# Altium schematic sheet TopLevelDesign.SchDoc
size B; SheetNumber: 2; SheetTotal: 8
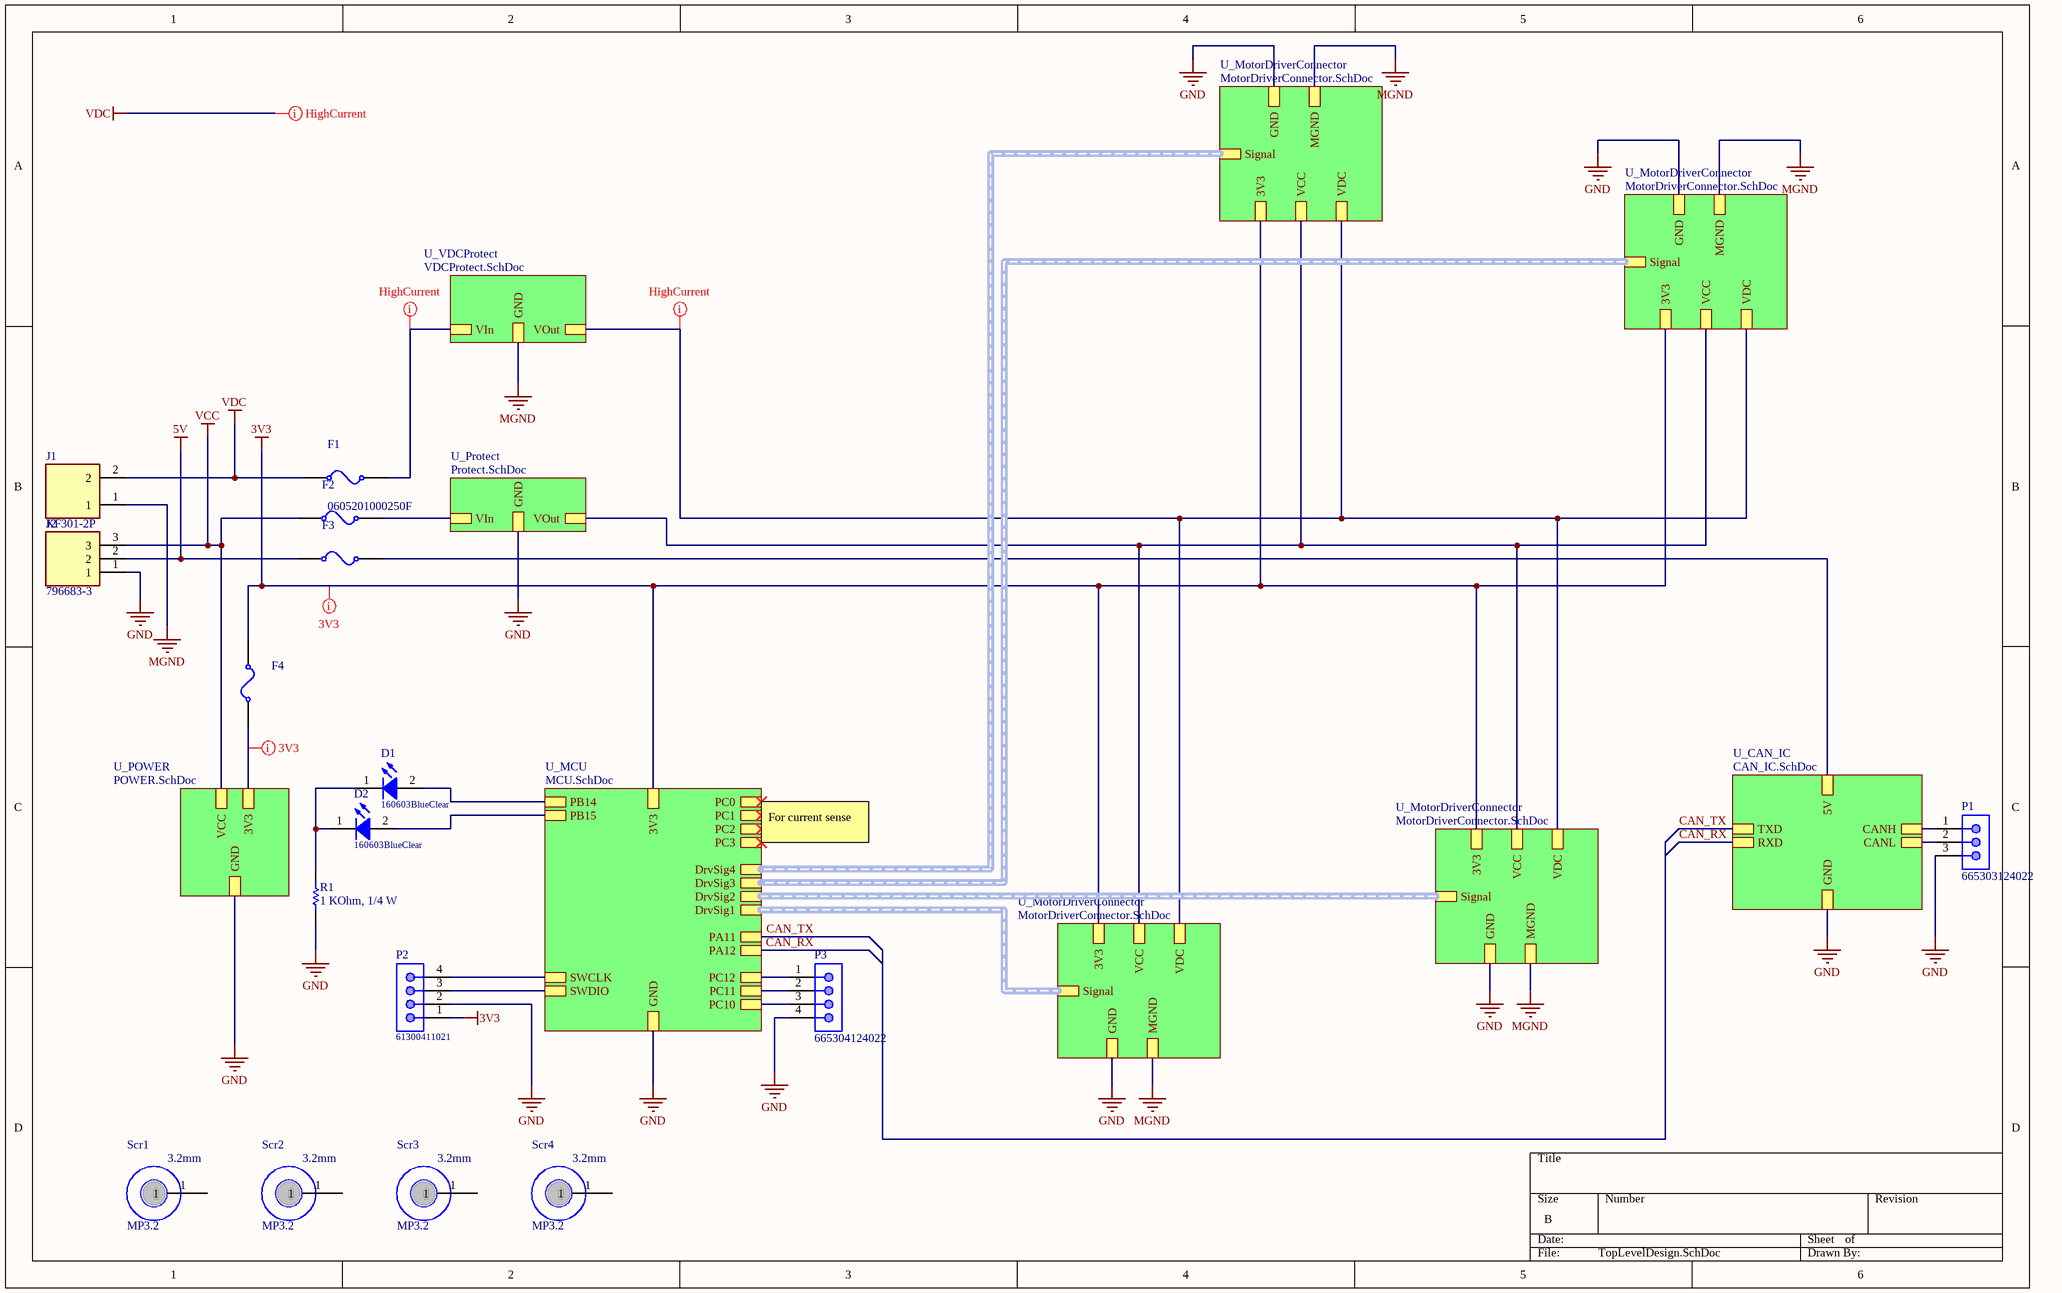
[diagram p0: TopLevelDesign.SchDoc]

## Parts
D1  160603BlueClear  [WL-SMCW_0603_H=0.7mm]
D2  160603BlueClear  [WL-SMCW_0603_H=0.7mm]
F1  0605201000250F  [Fuse_Clip_0520]
F2  061812110024  [Fuse_SMD_1812]  (value not drawn)
F3  061812110024  [Fuse_SMD_1812]  (value not drawn)
F4  061812020030  [Fuse_SMD_1812]  (value not drawn)
J1  KF301-2P  [HANDSON_KF301-2P]
J2  796683-3  [TE_796683-3]
P1  665303124022  [665303124022]
P2  61300411021  [61300411021]
P3  665304124022  [665304124022]
R1  value 1 KOhm, 1/4 W  [resistor_0603]  (hidden comment: 0006031021)
Scr1  MP3.2  [MP3.2]
Scr2  MP3.2  [MP3.2]
Scr3  MP3.2  [MP3.2]
Scr4  MP3.2  [MP3.2]

## Sub-sheets
U_CAN_IC = CAN_IC.SchDoc: CANH, CANL, TXD, RXD, 5V, GND
U_MCU = MCU.SchDoc: SWDIO, SWCLK, 3V3, GND, DrvSig1 (harness M_Driver_Signal1), DrvSig2 (harness M_Driver_Signal2), DrvSig3 (harness M_Driver_Signal3), DrvSig4 (harness M_Driver_Signal4), PC0, PC1, PC2, PC3, PC10, PC11, PC12, PA11, PA12, PB14, PB15
U_MotorDriverConnector = MotorDriverConnector.SchDoc: VCC, 3V3, GND, VDC, MGND, Signal (harness M_Driver_Entry)
U_MotorDriverConnector = MotorDriverConnector.SchDoc: VCC, 3V3, GND, VDC, MGND, Signal (harness M_Driver_Entry)
U_MotorDriverConnector = MotorDriverConnector.SchDoc: VCC, 3V3, GND, VDC, MGND, Signal (harness M_Driver_Entry)
U_MotorDriverConnector = MotorDriverConnector.SchDoc: VCC, 3V3, GND, VDC, MGND, Signal (harness M_Driver_Entry)
U_POWER = POWER.SchDoc: VCC, 3V3, GND
U_Protect = Protect.SchDoc: VIn, GND, VOut
U_VDCProtect = VDCProtect.SchDoc: VIn, GND, VOut

## Nets
3V3: F4.1 P2.1 ; sheet U_MotorDriverConnector/3V3, sheet U_MotorDriverConnector/3V3, sheet U_MotorDriverConnector/3V3, sheet U_MotorDriverConnector/3V3, sheet U_MCU/3V3
5V: F3.0 J2.2
GND: J2.1 P1.3 P2.2 P3.4 R1.1 ; sheet U_POWER/GND, sheet U_MotorDriverConnector/GND, sheet U_MotorDriverConnector/GND, sheet U_MotorDriverConnector/GND, sheet U_MotorDriverConnector/GND, sheet U_CAN_IC/GND, sheet U_MCU/GND, sheet U_Protect/GND
MGND: J1.1 ; sheet U_MotorDriverConnector/MGND, sheet U_MotorDriverConnector/MGND, sheet U_MotorDriverConnector/MGND, sheet U_MotorDriverConnector/MGND, sheet U_VDCProtect/GND
VCC: F2.0 J2.3 ; sheet U_POWER/VCC
VDC: F1.0 J1.2
CAN_RX: sheet U_CAN_IC/RXD, sheet U_MCU/PA12
CAN_TX: sheet U_CAN_IC/TXD, sheet U_MCU/PA11
NetD1_1: D1.1(K) D2.1(K) R1.2
NetD1_2: D1.2(A) ; sheet U_MCU/PB14
NetD2_2: D2.2(A) ; sheet U_MCU/PB15
NetF1_1: F1.1 ; sheet U_VDCProtect/VIn
NetF2_1: F2.1 ; sheet U_Protect/VIn
NetF3_1: F3.1 ; sheet U_CAN_IC/5V
NetF4_0: F4.0 ; sheet U_POWER/3V3
NetP1_1: P1.1 ; sheet U_CAN_IC/CANH
NetP1_2: P1.2 ; sheet U_CAN_IC/CANL
NetP2_3: P2.3 ; sheet U_MCU/SWDIO
NetP2_4: P2.4 ; sheet U_MCU/SWCLK
NetP3_1: P3.1 ; sheet U_MCU/PC12
NetP3_2: P3.2 ; sheet U_MCU/PC11
NetP3_3: P3.3 ; sheet U_MCU/PC10
(unnamed): sheet U_MotorDriverConnector/VCC, sheet U_MotorDriverConnector/VCC, sheet U_MotorDriverConnector/VCC, sheet U_MotorDriverConnector/VCC, sheet U_Protect/VOut
(unnamed): sheet U_MotorDriverConnector/VDC, sheet U_MotorDriverConnector/VDC, sheet U_MotorDriverConnector/VDC, sheet U_MotorDriverConnector/VDC, sheet U_VDCProtect/VOut

Not connected (* = marked no-connect by the designer): Scr1 1; Scr2 1; Scr3 1; Scr4 1

## Buses and harness runs
harness sheet U_MCU/DrvSig1 = sheet U_MotorDriverConnector/Signal
harness sheet U_MCU/DrvSig2 = sheet U_MotorDriverConnector/Signal
harness sheet U_MCU/DrvSig3 = sheet U_MotorDriverConnector/Signal
harness sheet U_MCU/DrvSig4 = sheet U_MotorDriverConnector/Signal

## Layout directives
rule Width Constraint [Pref Width = 50mil    Min Width = 50mil    Max Width = 100mil]: (no net found under the mark), NetF1_1, VDC
rule Width Constraint [Pref Width = 15mil    Min Width = 7mil    Max Width = 100mil]: 3V3, NetF4_0

## Notes on the sheet
- For current sense
- (in symbol CMP-143-000000-1) 3.2mm

## Library data of the parts
D1 D2 = CMP-004-00088-1: WL-SMCW SMT Mono-color Chip LED Waterclear, size 0603, Blue, 3.2V, 140deg; Type: Clear; Supplier 2 SN: 160-1647-2-ND; Pins: 2; Supplier 1 SN: 710-150060GS75000; ComponentLink3URL: https://www.digikey.com/en/products/detail/liteon/LTST-C191TBKT/388530; Color: Blue; Supplier 3 Name: ICDayRoi; Supplier 2 Name: Digi-Key; ComponentLink1URL: N/A; Source: WL-SMCW_0603.SchLib; ComponentLink4URL: https://www.thegioiic.com/led-xanh-duong-0603-dan-smd-trong-suot; Supplier 1 Name: Mouser; ComponentLink3Description: Supplier 2 URL; Component Type: Standard; ComponentLink1Description: Datasheet link; Value: Blue, 3.2V; ComponentLink2URL: https://www.mouser.vn/ProductDetail/Wurth-Elektronik/150060BS75003?qs=Li%252BoUPsLEnu8LvIbM48DKA%3D%3D; Size: 0603; Design Item ID: 160603BlueClear; Supplier 2 URL: https://www.digikey.com/en/products/detail/liteon/LTST-C191TBKT/388530; ComponentLink4Description: Supplier 3 URL; Supplier 3 URL: https://www.thegioiic.com/led-xanh-duong-0603-dan-smd-trong-suot; Supplier 3 SN: N/A; ComponentLink2Description: Supplier 1 URL; Supplier 1 URL: https://www.mouser.vn/ProductDetail/Wurth-Elektronik/150060BS75003?qs=Li%252BoUPsLEnu8LvIbM48DKA%3D%3D
F1 = CMP-005-00031-1: Glass Fuse, Size 0520, 250 VAC, 10A, F; Manufacturer: Littelfuse; Threshold Current: 100A (125VAC); Threshold Voltage: 250VAC; Supplier 1 SN: 576-0218010.HXP; Source: Fuse_Clip.SchLib; ComponentLink4Description: Supplier 3 URL; ComponentLink3URL: https://www.digikey.com/en/products/detail/littelfuse-inc/0218010-HXP/777141?s=N4IgTCBcDaIAxgIwA46LgOgBIA0AKIAugL5A; Supplier 1 Name: Mouser; Supplier 2 URL: https://www.digikey.com/en/products/detail/littelfuse-inc/0218010-HXP/777141?s=N4IgTCBcDaIAxgIwA46LgOgBIA0AKIAugL5A; Design Item ID: 0605201000250F; ComponentLink1URL: https://www.littelfuse.com/~/media/electronics/datasheets/fuses/littelfuse_fuse_234_datasheet.pdf.pdf; Value: 250 VAC, 10A; Supplier 2 SN: F2425-ND; Pins: 2; Hold Current: 10A; Supplier 2 Name: Digi-Key; Supplier 3 URL: https://www.thegioiic.com/cau-chi-ong-thuy-tinh-10a-5x20mm-toc-do-f; Component Type: Standard; ComponentLink4URL: https://www.thegioiic.com/cau-chi-ong-thuy-tinh-10a-5x20mm-toc-do-f; Fuse speed: F; ComponentLink3Description: Supplier 2 URL; Supplier 3 SN: N/A; ComponentLink2URL: https://www.mouser.vn/ProductDetail/Littelfuse/0218010.HXP?qs=YKoktUZms5K5aEWQkceb8A%3D%3D; Mounting Technology: Holder / Clip; ComponentLink2Description: Supplier 1 URL; Size: 0520; ComponentLink1Description: Datasheet link; Supplier 3 Name: thegioiic; Supplier 1 URL: https://www.mouser.vn/ProductDetail/Littelfuse/0218010.HXP?qs=YKoktUZms5K5aEWQkceb8A%3D%3D
F2 F3 = CMP-005-00055-1: Resettable Fuse, Size 1812, 24V, 1.1A; Manufacturer: Bourns; Threshold Current: 20A; Trip Current: 2.2A; ComponentLink2URL: https://www.mouser.vn/ProductDetail/Bourns/MF-MSMF110-24X-2?qs=tiksPeNXt0KSvkNsPEvQzw%3D%3D; ComponentLink1Description: Datasheet link; Supplier 2 SN: MF-MSMF110/24X-2TR-ND; Supplier 2 URL: https://www.mouser.vn/ProductDetail/Bourns/MF-MSMF110-24X-2?qs=tiksPeNXt0KSvkNsPEvQzw%3D%3D; Threshold Voltage: 24V; ComponentLink2Description: Supplier 1 URL; ComponentLink3URL: https://www.digikey.com/en/products/detail/bourns-inc/MF-MSMF110-24X-2/2127043?s=N4IgTCBcDaILIDEC0cDKiCMGAMB6MALABpIQC6AvkA; Size: 1812; Supplier 3 SN: MF-MSMF110/24X-2; ComponentLink1URL: https://www.bourns.com/docs/Product-Datasheets/mfnsmf.pdf; Value: 24V, 1.1A; Source: Fuse_SMD.SchLib; Supplier 3 Name: thegioiic; ComponentLink4Description: Supplier 3 URL; Supplier 2 Name: Digi-Key; ComponentLink3Description: Supplier 2 URL; Component Type: Standard; ComponentLink4URL: https://www.thegioiic.com/mf-msmf110-24x-2-cau-chi-tu-phuc-hoi-1812-24v-1-1a; Supplier 1 Name: Mouser; Supplier 3 URL: https://www.thegioiic.com/mf-msmf110-24x-2-cau-chi-tu-phuc-hoi-1812-24v-1-1a; Mounting Technology: SMT/SMD; Hold Current: 1.1A; Supplier 1 SN: 652-MF-MSMF110/24X-2; Pins: 2; Design Item ID: 061812110024; Supplier 1 URL: https://www.mouser.vn/ProductDetail/Bourns/MF-MSMF110-24X-2?qs=tiksPeNXt0KSvkNsPEvQzw%3D%3D
F4 = CMP-005-00050-1: Resettable Fuse, Size 1812, 30V, 0.2A; Manufacturer: Bourns; Threshold Current: 80A; Trip Current: 0.4A; ComponentLink4Description: Supplier 3 URL; ComponentLink2URL: https://www.mouser.vn/ProductDetail/Bourns/MF-MSMF020-2?qs=YYkh393lUtjbPn24kFIUNQ%3D%3D; Value: 30V, 0.2A; Supplier 3 URL: https://www.thegioiic.com/mf-msmf020-2-cau-chi-tu-phuc-hoi-1812-0-20a-30v; Supplier 1 URL: https://www.mouser.vn/ProductDetail/Bourns/MF-MSMF020-2?qs=YYkh393lUtjbPn24kFIUNQ%3D%3D; Component Type: Standard; Supplier 2 SN: MF-MSMF020-2TR-ND; ComponentLink1URL: https://www.bourns.com/docs/Product-Datasheets/mfnsmf.pdf; Pins: 2; Hold Current: 0.2A; ComponentLink1Description: Datasheet link; Supplier 1 SN: 652-MF-MSMF020-2; ComponentLink2Description: Supplier 1 URL; Supplier 2 URL: https://www.mouser.vn/ProductDetail/Bourns/MF-MSMF020-2?qs=YYkh393lUtjbPn24kFIUNQ%3D%3D; Supplier 1 Name: Mouser; ComponentLink3URL: https://www.digikey.com/en/products/detail/bourns-inc/MF-MSMF020-2/662814?s=N4IgTCBcDaILIDEC0cDKiAMYNLAAhAF0BfIA; Mounting Technology: SMT/SMD; Threshold Voltage: 30V; ComponentLink4URL: https://www.thegioiic.com/mf-msmf020-2-cau-chi-tu-phuc-hoi-1812-0-20a-30v; Supplier 2 Name: Digi-Key; Supplier 3 Name: thegioiic; Design Item ID: 061812020030; ComponentLink3Description: Supplier 2 URL; Size: 1812; Source: Fuse_SMD.SchLib; Supplier 3 SN: MF-MSMF020-2
J1 = CMP-118-000001-1: 2 Pin Terminal Block 5mm Pitch; MP: KF301-2P; Design Item ID: KF301-2P; Value: *; Price: None; Package: None; Availability: Unavailable; Source: KF301-2P.SchLib
J2 = CMP-118-000000-1: Wire to Board 3 Position 5 mm Pitch 30-12 AWG Euro Style Terminal Block; MF: TE Connectivity; MP: 796683-3; Price: None; SnapEDA_Link: https://www.snapeda.com/parts/796683-3/TE%20Connectivity/view-part/2375698/?ref=snap; TE_purchase_URL: https://www.te.com/usa-en/product-796683-3.html?te_bu=Cor&te_type=disp&te_campaign=seda_glo_cor-seda-global-disp-prtnr-fy19-seda-model-bom-cta_sma-317_1&elqCampaignId=32493; Value: *; Design Item ID: 796683-3; EU_RoHS_Compliance: Compliant with Exemptions; Availability: Unavailable; Package: None; Source: KF301-3P.SchLib
P1 = CMP-002-01223-1: WR-WTB SMT Male Vertical Shrouded Header, pitch 1mm, 3p; Contact Resistance: 20mOhm; Rated Current: 1A; Withstanding Voltage: 500VAC; Value: 1A, 125 V (AC); Pin Number: 3; Working Voltage: 50VAC; Supplier 1 URL: https://www.mouser.vn/ProductDetail/Wurth-Elektronik/665303124022?qs=a9WhcLg8qCyV5ri9HU4hCQ%3D%3D; ComponentLink2URL: https://www.we-online.com/catalog/datasheet/665303124022.pdf; Packaging: Tape and Reel; Supplier 2 SN: N/A; Source: WR-WTB_1.00mm.SchLib; Publisher: Wurth Elektronik; Supplier 2 Name: Digi-Key; Supplier 3 SN: N/A; Published Date: January 2020; ComponentLink4Description: Global Supply; Mounting Technology: SMT; ComponentLink1Description: Manufacturer; Supplier 3 URL: N/A; Supplier 2 URL: N/A; Operating Temperature: -25 to +85degC; Type: Vertical; ComponentLink3URL: https://www.we-online.com/en/components/products/WTB_1_00_SMT_MALE_VERTICAL_SHROUDED_HEADER_6653XX124022?sq=665303124022#665303124022; Design Item ID: 665303124022; Component Type: Standard; Pitch: 1mm; ComponentLink2Description: Datasheet; Part Number: 665303124022; Gender: Male; Supplier 1 SN: 710-665303124022; Pins: 3; ComponentLink4URL: https://www.mouser.vn/ProductDetail/Wurth-Elektronik/665303124022?qs=a9WhcLg8qCyV5ri9HU4hCQ%3D%3D; Supplier 1 Name: Mouser; Supplier 3 Name: thegioiic; ComponentLink1URL: http://www.we-online.de; ComponentLink3Description: Global Supply
P2 = CMP-002-00473-1: WR-PHD Pin Header, THT, pitch 2.54mm, Single Row, Angled, 4p; Manufacturer: Wurth Elektronik; Working Voltage: 250VAC; Pin Number: 4; Withstanding Voltage: 500VAC; Contact Resistance: 20mOhm; Supply name 1: Mouser; Rated Current: 3A; ComponentLink3URL: https://www.we-online.com/en/components/products/PHD_2_54_THT_ANGLED_PIN_HEADER_6130XX11021?sq=61300411021#61300411021; Design Item ID: 61300411021; Mounting Technology: THT; Supplier 2 SN: N/A; Manufacturer Part Number: 61300411021; ComponentLink2Description: Datasheet; Supplier 3 URL: N/A; Source: WR-PHD_Pin Header_2.54mm.SchLib; Gender: Pin Header; Supplier 1 URL: https://www.mouser.vn/ProductDetail/Wurth-Elektronik/61300411021?qs=PhR8RmCirEZA1t3zcLZqlA%3D%3D; ComponentLink4URL: https://www.mouser.vn/ProductDetail/Wurth-Elektronik/61300411021?qs=PhR8RmCirEZA1t3zcLZqlA%3D%3D; Supplier 2 URL: N/A; ComponentLink1Description: Manufacturer; Pins: 4; ComponentLink4Description: Global Supply; Orientation: Angled; Pitch: 2.54mm; Supplier 1 Name: Mouser; Row Number: Single; ComponentLink2URL: https://www.we-online.com/catalog/datasheet/61300411021.pdf; Supplier 3 Name: thegioiic; ComponentLink3Description: Global Supply; Published Date: May 2020; Operating Temperature: -40 to +105degC; Supplier 2 Name: Digi-Key; Component Type: Standard; Supplier 3 SN: N/A; ComponentLink1URL: http://www.we-online.de; Supplier 1 SN: 710-61300411021; Packaging: Bag
P3 = CMP-002-01224-1: WR-WTB SMT Male Vertical Shrouded Header, pitch 1mm, 4p; Rated Current: 1A; Value: 1A, 125 V (AC); Contact Resistance: 20mOhm; Working Voltage: 50VAC; Withstanding Voltage: 500VAC; Pin Number: 4; Mounting Technology: SMT; Supplier 3 Name: thegioiic; Supplier 2 URL: N/A; Supplier 3 URL: N/A; Packaging: Tape and Reel; Gender: Male; ComponentLink4URL: https://www.mouser.vn/ProductDetail/Wurth-Elektronik/665304124022?qs=a9WhcLg8qCx8aEna1KcTfg%3D%3D; Source: WR-WTB_1.00mm.SchLib; ComponentLink3Description: Global Supply; Supplier 3 SN: N/A; ComponentLink4Description: Global Supply; ComponentLink2URL: https://www.we-online.com/catalog/datasheet/665304124022.pdf; Component Type: Standard; Type: Vertical; ComponentLink1URL: http://www.we-online.de; Pins: 4; Publisher: Wurth Elektronik; Supplier 1 SN: 710-665304124022; ComponentLink2Description: Datasheet; Supplier 2 Name: Digi-Key; ComponentLink1Description: Manufacturer; Operating Temperature: -25 to +85degC; ComponentLink3URL: https://www.we-online.com/en/components/products/WTB_1_00_SMT_MALE_VERTICAL_SHROUDED_HEADER_6653XX124022?sq=665304124022#665304124022; Published Date: January 2020; Supplier 1 URL: https://www.mouser.vn/ProductDetail/Wurth-Elektronik/665304124022?qs=a9WhcLg8qCx8aEna1KcTfg%3D%3D; Supplier 2 SN: N/A; Supplier 1 Name: Mouser; Design Item ID: 665304124022; Pitch: 1mm; Part Number: 665304124022
R1 = CMP-009-00186-1: RES, size 0603, 1 KOhm, 1/4 W; Manufacture  SN: OEM; Rated Power: 1/4 W; Resistance Tolerance: +/-1%; Supplier 1 SN: 71-RCS06031K00FKEA; ComponentLink4Description: Supplier 3 URL; ComponentLink2Description: Supplier 1 URL; Supplier 3 SN: N/A; Supplier 2 Name: Digi-Key; ComponentLink3Description: Supplier 2 URL; Pins: 2; ComponentLink4URL: N/A; Source: Resistor_0603.SchLib; ComponentLink3URL: https://www.digikey.com/en/products/detail/yageo/SR0603FR-7T1KL/9373103; Supplier 2 SN: YAG5829TR-ND YAG5829CT-ND YAG5829DKR-ND; Supplier 2 URL: https://www.digikey.com/en/products/detail/yageo/SR0603FR-7T1KL/9373103; Supplier 1 Name: Mouser; Component Type: Standard; ComponentLink2URL: N/A; Size: 0603; Supplier 1 URL: https://www.mouser.vn/ProductDetail/Vishay-Dale/RCS06031K00FKEA?qs=sGAEpiMZZMvdGkrng054t9clqp6gtJJdzI9PGMrTQi4RTIuHToNahw%3D%3D; Supplier 3 URL: N/A; Design Item ID: 0006031021; Mounting Technology: SMT; ComponentLink1URL: https://www.yageo.com/upload/media/product/productsearch/datasheet/rchip/PYu-SR_20105_RoHS_L_10.pdf; ComponentLink1Description: Datasheet link; Supplier 3 Name: thegioiic; Manufacture  Name: OEM
Scr1-Scr4 = CMP-143-000000-1: Component Type: Standard; Pin Count: 1; Source: MP_3P2.SchLib; Design Item ID: MP3.2